# EAGLE design power_supply_board_basic (EAGLE 7.7.0)
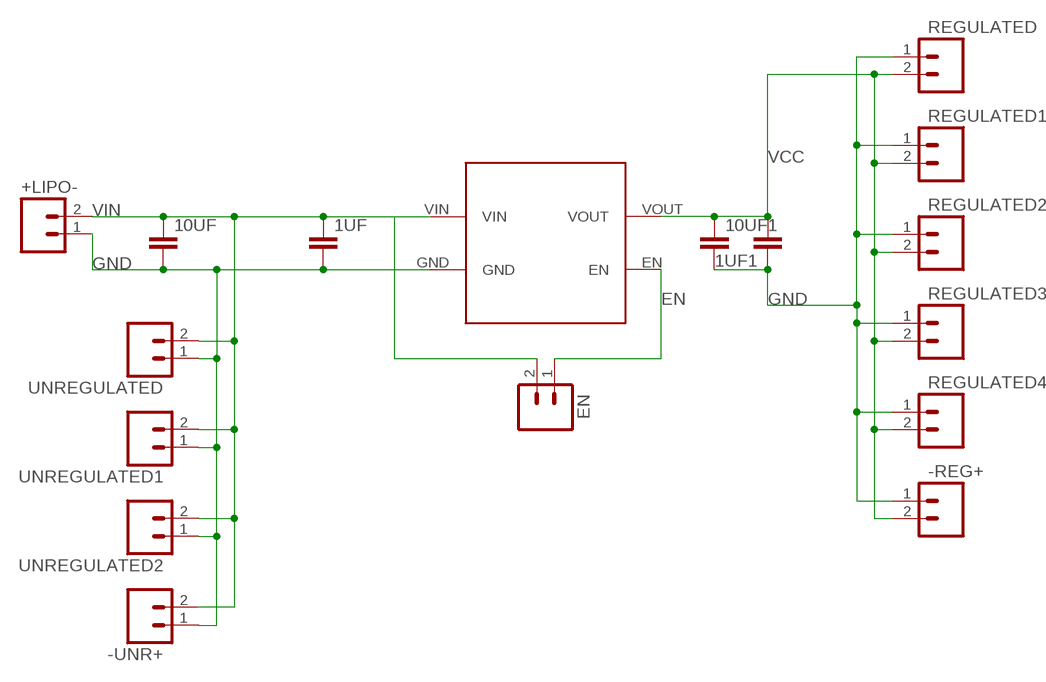
[diagram p0: schematic, sheet 1]

## Parts
1UF  CAP0603-CAP  [0603-CAP]
1UF1  CAP0603-CAP  [0603-CAP]
10UF  CAP0603-CAP  [0603-CAP]
10UF1  CAP0603-CAP  [0603-CAP]
+LIPO-  M02PTH  [1X02]
-REG+  M02PTH  [1X02]
-UNR+  M02PTH  [1X02]
EN  M02PTH  [1X02]
REGULATED  M02PTH  [1X02]
REGULATED1  M02PTH  [1X02]
REGULATED2  M02PTH  [1X02]
REGULATED3  M02PTH  [1X02]
REGULATED4  M02PTH  [1X02]
U$2  AP2112K  [AP2112K-SOT23-5]
UNREGULATED  M02PTH  [1X02]
UNREGULATED1  M02PTH  [1X02]
UNREGULATED2  M02PTH  [1X02]

## Nets
EN: EN.1 U$2.EN
GND: 1UF1.1 1UF.2 10UF1.2 10UF.2 +LIPO-.1 -REG+.1 -UNR+.1 REGULATED1.1 REGULATED2.1 REGULATED3.1 REGULATED4.1 REGULATED.1 U$2.GND UNREGULATED1.1 UNREGULATED2.1 UNREGULATED.1
VCC: 1UF1.2 10UF1.1 -REG+.2 REGULATED1.2 REGULATED2.2 REGULATED3.2 REGULATED4.2 REGULATED.2 U$2.VOUT
VIN: 1UF.1 10UF.1 +LIPO-.2 -UNR+.2 EN.2 U$2.VIN UNREGULATED1.2 UNREGULATED2.2 UNREGULATED.2

## Library data of the parts
1UF 1UF1 10UF 10UF1 = SparkFun-Passives:CAP: Capacitor Standard 0603 ceramic capacitor, and 0.1" leaded capacitor.
+LIPO- -REG+ -UNR+ EN REGULATED REGULATED1-REGULATED4 UNREGULATED UNREGULATED1 UNREGULATED2 = SparkFun-Connectors:M02: Standard 2-pin 0.1" header. Use with - straight break away headers ( PRT-00116) - right angle break away headers (PRT-00553) - swiss pins (PRT-00743) - machine pins (PRT-00117) - female headers (PRT-00115) Molex polarized connector foot print use with: PRT-08233 with associated crimp pins and housings. 2.54_SCREWTERM for use with PRT-10571. 3.5mm Screw Terminal footprints for PRT-08084 5mm Screw Terminal footprints for use with PRT-08432
U$2 = TPL5111DDCR:AP2112K

## Board
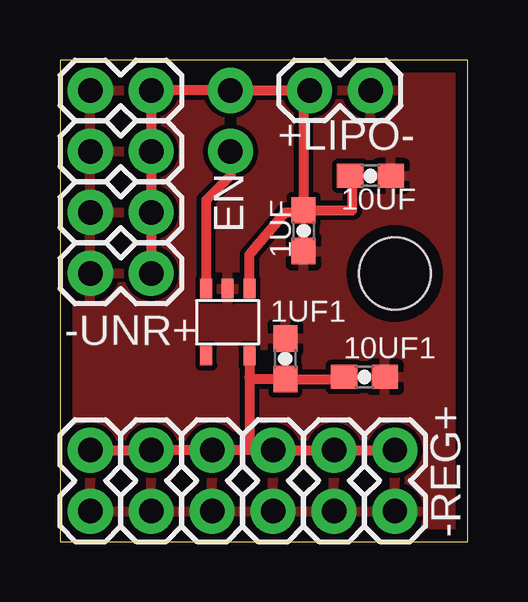
[diagram p1: board, top side]
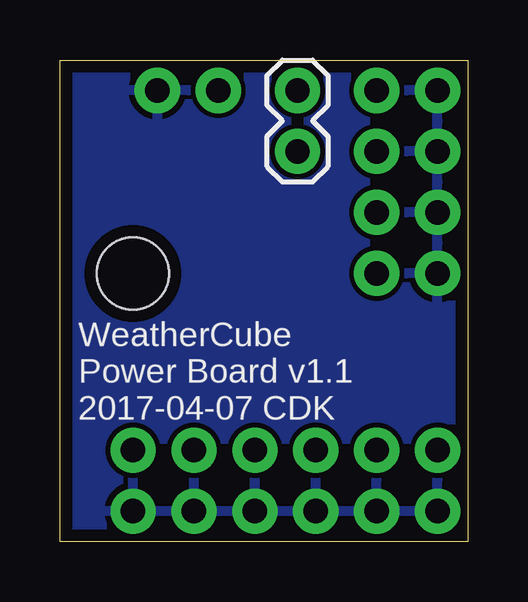
[diagram p2: board, bottom side, seen from below]

Size 17.02 x 20.07 mm. Coordinates in mm from the lower left corner, seen from the top.
Outline: 0,0 17.02,0 17.02,20.07 0,20.07 0,0
Copper layers (1*16): Top 0.035mm / dielectric 1.5mm / Bottom 0.035mm
Design rules "default *": minimum track width 10mil, minimum drill 24mil, track to track 8mil, track to pad 8mil, pad to pad 8mil, via to via 8mil, smd to smd 8mil, copper to edge 20mil, drill to drill 8mil, minimum pad ring 10mil, minimum via ring 8mil, stop-mask expansion 4mil, vias tented up to drill 13mil, thermal gap 10mil
Holes 3 mm at 13.97,11.18

### Footprints (pad centres in the part's own frame; a part is rotated, then mirrored left to right if it is on the bottom)
0603-CAP = smd 1.1 x 1: 1 -0.85,0; 2 0.85,0
1X02 = drill 1.016 pad 1.88: 1 0,0; 2 2.54,0
AP2112K-SOT23-5 = smd 0.8 x 0.5: EN 0,0; GND 0,0.9; NC 2.8,0; VIN 0,1.8; VOUT 2.8,1.8

### Placement (x,y rotation side)
1UF  10.16,12.95 270 top
1UF1  9.4,7.62 270 top
10UF  12.95,15.24 0 top
10UF1  12.7,6.86 0 top
+LIPO-  12.95,18.8 180 top
-REG+  13.97,1.27 90 top
-UNR+  1.27,11.18 0 top
EN  7.11,16.26 90 bottom
REGULATED  1.27,1.27 90 top
REGULATED1  3.81,1.27 90 top
REGULATED2  6.35,1.27 90 top
REGULATED3  8.89,1.27 90 top
REGULATED4  11.43,1.27 90 top
U$2  6.1,10.54 270 top
UNREGULATED  1.27,18.8 0 top
UNREGULATED1  1.27,16.26 0 top
UNREGULATED2  1.27,13.72 0 top

### Tracks (layer width: path | path; a pad name or v marks a point on that pad's centre or on a via)
EN
  Top 0.406: EN.1 7.11,15.24 6.1,14.22 U$2.EN
GND
  pour Bottom: -3.17,35.56 27.3,35.56 27.3,-1.91 -3.17,-1.91
  pour Top: -3.05,23.88 21.59,23.88 21.59,-2.29 -3.05,-2.29
VCC
  Top 0.406: 7.87,3.81 REGULATED3.2 REGULATED4.2 -REG+.2 | 7.87,3.81 REGULATED2.2 REGULATED1.2 REGULATED.2 | U$2.VOUT 7.9,6.86 | 7.9,6.86 7.9,4.59 7.87,3.81 | 7.9,6.86 8.06,6.77 1UF1.2 11.68,6.77 10UF1.1
VIN
  Top 0.406: -UNR+.2 UNREGULATED2.2 UNREGULATED1.2 UNREGULATED.2 EN.2 +LIPO-.2 10.16,18.54 1UF.1 | 1UF.1 12.19,13.8 12.19,15.24 10UF.1 | U$2.VIN 7.9,11.96 9.4,13.72 10.07,13.72 1UF.1

### Text on the board
bNames: WeatherCube / Power Board v1.1 / 2017-04-07 CDK